# Altium schematic sheet mcp9800.SchDoc
size A4
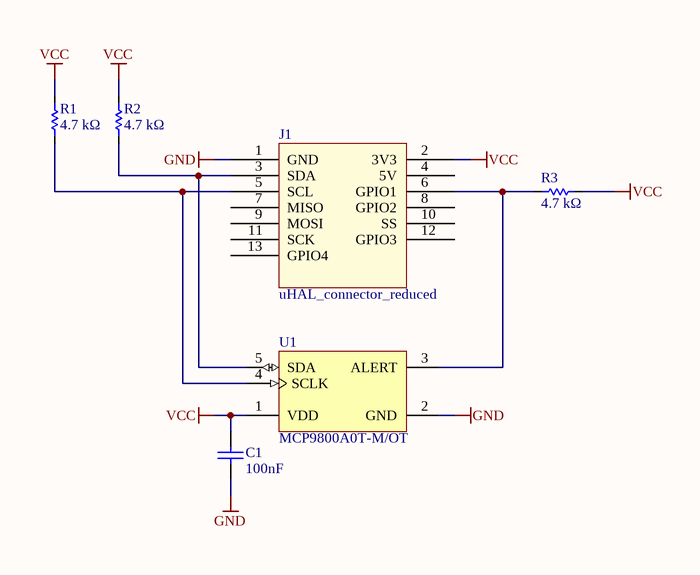
[diagram p0: mcp9800.SchDoc]

## Parts
C1  Capacitance: 100nF  [CAPC1608X90X35ML10T15]  (hidden comment: Murata GCM188R71H104KA57D)
J1  uHAL_connector_reduced  [PCB-45ncoppm4oopozvqifsq-1]
R1  Resistance: 4.7 kΩ  [PCB-cmzy4aezi5zhn2bew7lt-1]  (hidden comment: CRCW06034K70FKEAHP)
R2  Resistance: 4.7 kΩ  [PCB-cmzy4aezi5zhn2bew7lt-1]  (hidden comment: CRCW06034K70FKEAHP)
R3  Resistance: 4.7 kΩ  [PCB-cmzy4aezi5zhn2bew7lt-1]  (hidden comment: CRCW06034K70FKEAHP)
U1  MCP9800A0T-M/OT  [SOT-23-OT5_L]

## Nets
GND: C1.1 J1.1(GND) U1.2(GND)
VCC: C1.2 J1.2(3V3) R1.2 R2.2 R3.1 U1.1(VDD)
NetJ1_3: J1.3(SDA) R2.1 U1.5(SDA)
NetJ1_5: J1.5(SCL) R1.1 U1.4(SCLK)
NetJ1_6: J1.6(GPIO1) R3.2 U1.3(ALERT)

Not connected (* = marked no-connect by the designer): J1 4(5V) 7(MISO) 8(GPIO2) 9(MOSI) 10(SS) 11(SCK) 12(GPIO3) 13(GPIO4)

## Library data of the parts
C1 = CMP-119667-3: CAP CER 0.1UF 50V 10% X7R 0603; Lead-Free Status: Lead Free; Voltage Rating (DC): 50.0 V; Capacitance Tolerance: ±10%; Dielectric Characteristic: X7R; Octopart Url: https://octopart.com/gcm188r71h104ka57d-murata-7894792; OctopartID: 3480fdf266eeeb47; Packaging: Cut Tape (CT); REACH SVHC Compliance: No SVHC; RoHS: Compliant
J1 = CMP-2q23h2cwhjlfm8s6r7i8-1: connector for uHAL with reduced pin number; CustomComponentID: 2q23h2cwhjlfm8s6r7i8
R1-R3 = CMP-40e08b60e91c9f27-1: Surface Mount Chip Resistor, Thick Film, AEC-Q200 CRCW Series, 4.7 kohm, 250 mW, 1%, 75 V; Case/Package (SI): 1608; Voltage Rating (DC): 75.0 V; Lead-Free Status: Lead Free; Power Rating: 250 mW; Case/Package: 0603; Number of Pins: 2; REACH SVHC Compliance: No SVHC; OctopartID: 40e08b60e91c9f27; Packaging: Cut Tape (CT); Mounting Style: Surface Mount; Octopart URL: http://octopart.com/crcw06034k70fkeahp-vishay-42634394; Resistance Tolerance: ±1%; Manufacturer Part Number: CRCW06034K70FKEAHP
U1 = CMP-984305-2: 2-Wire High-Accuracy Temperature Sensor, Slave Address 000, 5-Pin SOT-23, -55°C to +125°C Temperature, Tape and Reel; Lead-Free Status: Lead Free; Number of Bits: 12; Output Current: 1e-06 A; Output Voltage: 0.4 V; Supply Current: 0.0002 A; Case/Package: SOT-23; Lifecycle Status: Active; Mounting Style: Surface Mount; Number of Pins: 5; Octopart Url: https://octopart.com/mcp9800a0t-m%2Fot-microchip-515922; OctopartID: 55e29cefafd68a25; Packaging: Cut Tape (CT); REACH SVHC Compliance: No SVHC; RoHS: Compliant